# Altium schematic sheet 07_EL_CON.SchDoc
size A4
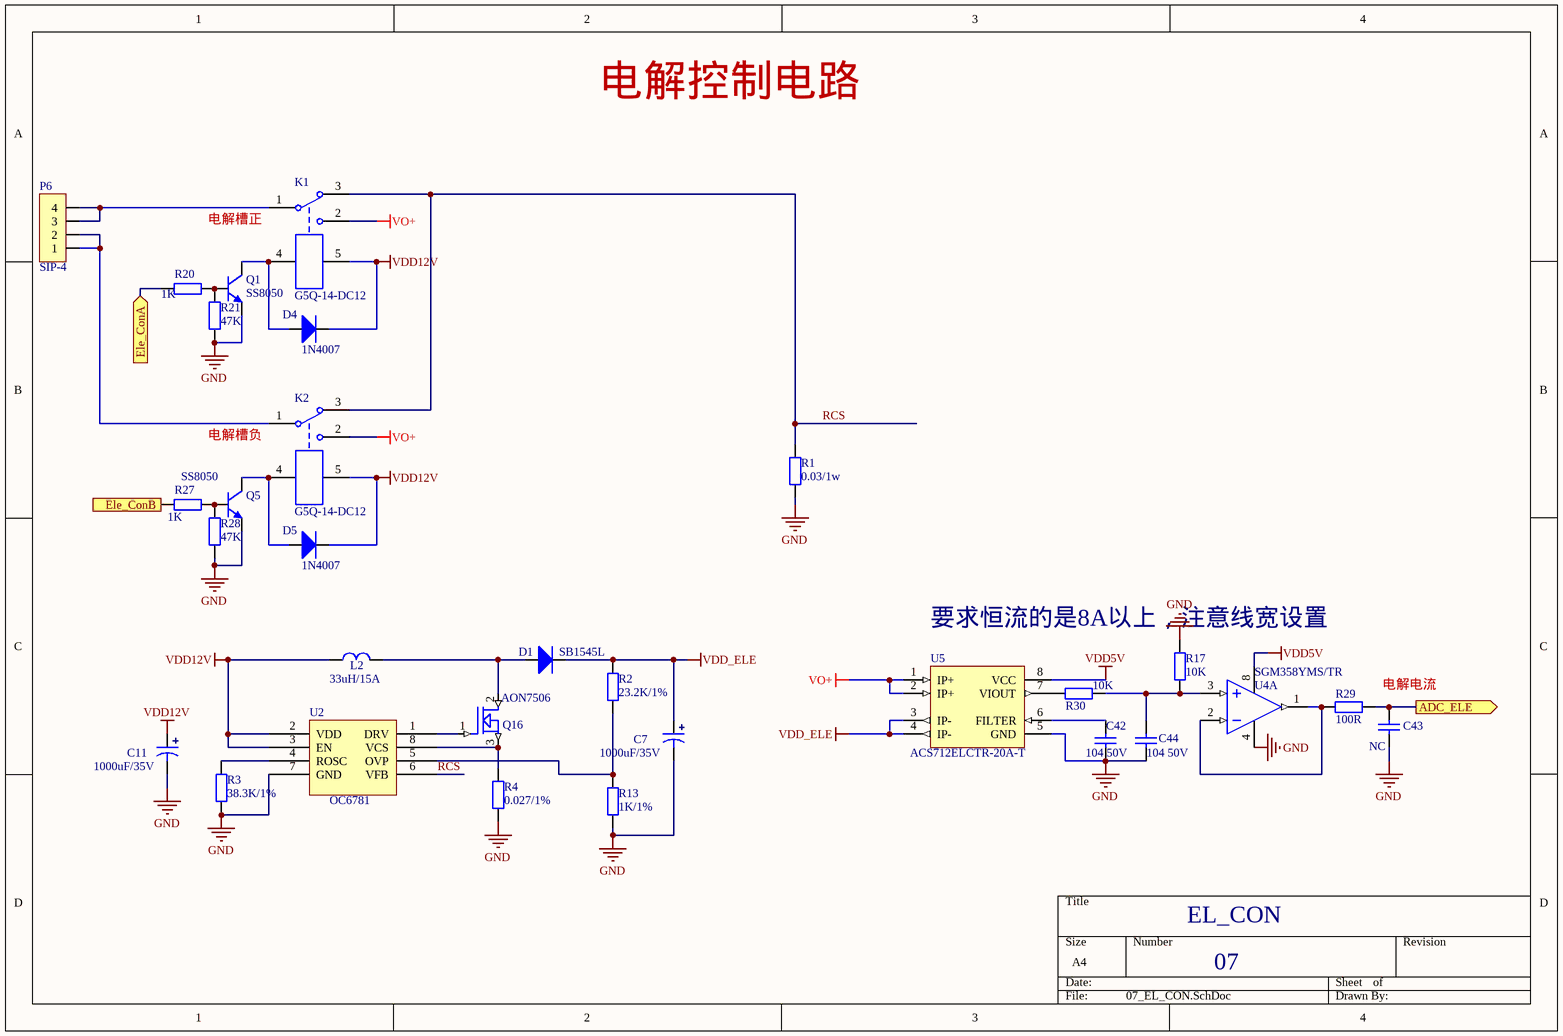
[diagram p0: 07_EL_CON.SchDoc]

## Parts
C7  1000uF/35V  [10*16]
C11  1000uF/35V  [10*16]
C42  104 50V  [SMD-0603C]
C43  NC  [SMD-0603C]
C44  104 50V  [SMD-0603C]
D1  SB1545L  [TO227]
D4  1N4007  [DO-214-AC]
D5  1N4007  [DO-214-AC]
K1  G5Q-14-DC12  [G5Q-14]
K2  G5Q-14-DC12  [G5Q-14]
L2  33uH/15A  [INDUCTOR_34*18]
P6  SIP-4  [VH-AW-3.96*4P]
Q1  SS8050  [SOT-23]
Q5  SS8050  [SOT-23]
Q16  AON7506  [DFN3*3-8]
R1  0.03/1w  [2512R]
R2  23.2K/1%  [SMD-0603]
R3  38.3K/1%  [SMD-0603]
R4  0.027/1%  [2512r]
R13  1K/1%  [SMD-0603]
R17  10K  [SMD-0603]
R20  1K  [SMD-0603]
R21  47K  [SMD-0603]
R27  1K  [SMD-0603]
R28  47K  [SMD-0603]
R29  100R  [SMD-0603]
R30  10K  [SMD-0603]
U2  OC6781  [SOP127P600X265_HS-9N]
U4  SGM358YMS/TR  [MSOP-8]  (part A of 2)
U5  ACS712ELCTR-20A-T  [SO-8]

## Ports
ADC_ELE (out), Ele_ConA (in), Ele_ConB (in)

## Nets
GND: C7.2 C11.2 C42.2 C43.1 C44.2 Q1.2(E) Q5.2(E) R1.2 R3.2 R4.2 R13.2 R17.1 R21.1 R28.1 U2.7(GND) U4.4(V-) U5.5(GND)
VDD5V: U4.8(V+) U5.8(VCC)
VDD12V: C11.1 D4.2(K) D5.2(K) K1.5 K2.5 L2.1 U2.2(VDD) U2.3(EN)
VDD_ELE: C7.1 D1.2(K) R2.1 U5.3(IP-) U5.4(IP-)
VO+: K1.2 K2.2 U5.1(IP+) U5.2(IP+)
ADC_ELE: C43.2 R29.1 ; port ADC_ELE
Ele_ConA: R20.1 ; port Ele_ConA
Ele_ConB: R27.1 ; port Ele_ConB
RCS: K1.3 K2.3 R1.1 U2.6(VFB)
NetC42_1: C42.1 U5.6(FILTER)
NetC44_1: C44.1 R17.2 R30.1 U4.3(IN1+)
NetD1_1: D1.1(A) L2.2 Q16.2(D)
NetD4_1: D4.1(A) K1.4 Q1.3(C)
NetD5_1: D5.1(A) K2.4 Q5.3(C)
NetK1_1: K1.1 P6.3 P6.4
NetK2_1: K2.1 P6.1 P6.2
NetQ1_1: Q1.1(B) R20.2 R21.2
NetQ5_1: Q5.1(B) R27.2 R28.2
NetQ16_1: Q16.1(G) U2.1(DRV)
NetQ16_3: Q16.3(S) R4.1 U2.8(VCS)
NetR2_2: R2.2 R13.1 U2.5(OVP)
NetR3_1: R3.1 U2.4(ROSC)
NetR29_2: R29.2 U4.1(OUT1) U4.2(IN1-)
NetR30_2: R30.2 U5.7(VIOUT)

## Notes on the sheet
- 电解控制电路
- 电解槽正
- 电解槽负
- 要求恒流的是8A以上，注意线宽设置
- 电解电流
- EL_CON
- 07

## Library data of the parts
C7 C11 = CAP2: 电解电容
C42 = C: 贴片电容 10%
C43 C44 = CAP4: 贴片电容 10%
D1 = DIODE2: 肖特基二极管
D4 D5 = DIODE2: 贴片二极管
K1 K2 = JDQ1: 5V 继电器
L2 = Inductor1: 10uH 1A
P6 = SIP-4: 3.96 4P 直插
Q1 Q5 = NPN-1: 三极管
Q16 = MOSFET N
R1-R4 R13 = R: 贴片电阻 5%
R17 R30 = RES0: 贴片电阻 1%
R20 R21 R27 R28 = RES2: 贴片电阻 5%
R29 = RES0: 贴片电阻 5%
U4 = LM358: 运算放大器
U5 = ACS712: HALL 20A 电流传感器